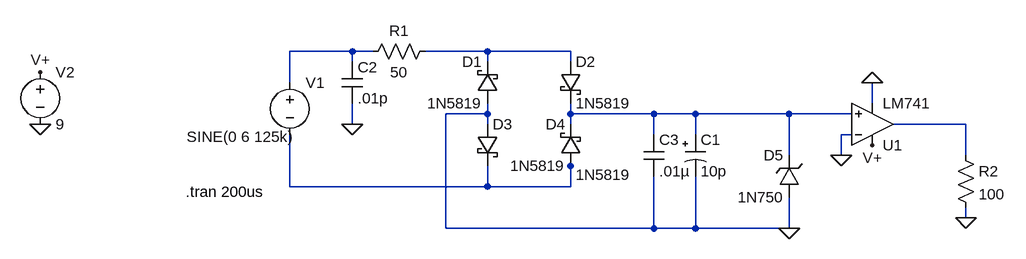
[diagram p0: schematic Receiver_9vBattery.asc]
Receiver_9vBattery.asc, the LTspice schematic file:
Version 4
SHEET 1 1044 680
WIRE 32 64 -64 64
WIRE 64 64 32 64
WIRE 240 64 144 64
WIRE 368 64 240 64
WIRE 32 80 32 64
WIRE 240 80 240 64
WIRE 368 80 368 64
WIRE -64 112 -64 64
WIRE 832 144 832 112
WIRE 240 160 240 144
WIRE 240 160 176 160
WIRE 368 160 368 144
WIRE 496 160 368 160
WIRE 560 160 496 160
WIRE 704 160 560 160
WIRE 800 160 704 160
WIRE 32 176 32 144
WIRE 240 176 240 160
WIRE 368 176 368 160
WIRE 976 176 864 176
WIRE 496 192 496 160
WIRE 560 192 560 160
WIRE 800 192 784 192
WIRE 704 224 704 160
WIRE 784 224 784 192
WIRE 976 224 976 176
WIRE 368 240 368 224
WIRE -64 272 -64 192
WIRE 240 272 240 240
WIRE 240 272 -64 272
WIRE 368 272 368 240
WIRE 368 272 240 272
WIRE 976 320 976 304
WIRE 176 336 176 160
WIRE 496 336 496 256
WIRE 496 336 176 336
WIRE 560 336 560 256
WIRE 560 336 496 336
WIRE 704 336 704 288
WIRE 704 336 560 336
FLAG 704 336 0
FLAG 32 176 0
FLAG -448 176 0
FLAG -448 96 V+
FLAG 976 320 0
FLAG 832 112 0
FLAG 784 224 0
FLAG 832 208 V+
SYMBOL voltage -64 96 R0
WINDOW 3 -159 99 Left 2
WINDOW 123 0 0 Left 2
WINDOW 39 0 0 Left 2
SYMATTR InstName V1
SYMATTR Value SINE(0 6 125k)
SYMBOL res 48 80 R270
WINDOW 0 32 56 VTop 2
WINDOW 3 0 56 VBottom 2
SYMATTR InstName R1
SYMATTR Value 50
SYMBOL schottky 256 144 R180
WINDOW 0 24 64 Left 2
WINDOW 3 24 0 Left 2
SYMATTR InstName D1
SYMATTR Value 1N5819
SYMATTR Description Diode
SYMATTR Type diode
SYMBOL polcap 544 192 R0
SYMATTR InstName C1
SYMATTR Value 10p
SYMBOL schottky 352 80 R0
SYMATTR InstName D2
SYMATTR Value 1N5819
SYMATTR Description Diode
SYMATTR Type diode
SYMBOL schottky 224 176 R0
WINDOW 3 152 78 Left 2
SYMATTR InstName D3
SYMATTR Value 1N5819
SYMATTR Description Diode
SYMATTR Type diode
SYMBOL schottky 384 240 R180
WINDOW 0 24 64 Left 2
WINDOW 3 24 0 Left 2
SYMATTR InstName D4
SYMATTR Value 1N5819
SYMATTR Description Diode
SYMATTR Type diode
SYMBOL cap 16 80 R0
SYMATTR InstName C2
SYMATTR Value .01p
SYMBOL cap 480 192 R0
SYMATTR InstName C3
SYMATTR Value .01µ
SYMBOL zener 720 288 R180
WINDOW 0 24 64 Left 2
WINDOW 3 24 0 Left 2
SYMATTR InstName D5
SYMATTR Value 1N750
SYMBOL Opamps\\LM741 832 240 M180
SYMATTR InstName U1
SYMBOL voltage -448 80 R0
WINDOW 123 0 0 Left 2
WINDOW 39 0 0 Left 2
SYMATTR InstName V2
SYMATTR Value 9
SYMBOL res 960 208 R0
SYMATTR InstName R2
SYMATTR Value 100
TEXT -224 280 Left 2 !.tran 200us

The netlist it stands for:
* Receiver_9vBattery.asc
V1 N001 N005 SINE(0 6 125k)
R1 N001 N002 50
D1 0 N002 1N5819
C1 N003 0 10p
D2 N002 N003 1N5819
D3 0 N005 1N5819
D4 N005 N003 1N5819
C2 N001 0 .01p
C3 N003 0 .01µ
D5 0 N003 1N750
XU1 N003 0 V+ 0 N004 LM741  ; pins In+ In- V+ V- OUT
V2 V+ 0 9
R2 N004 0 100
.model D D
.lib standard.dio
.tran 200us
.lib LM741.lib
.backanno
.end